# Altium project CBL003.PrjPCB
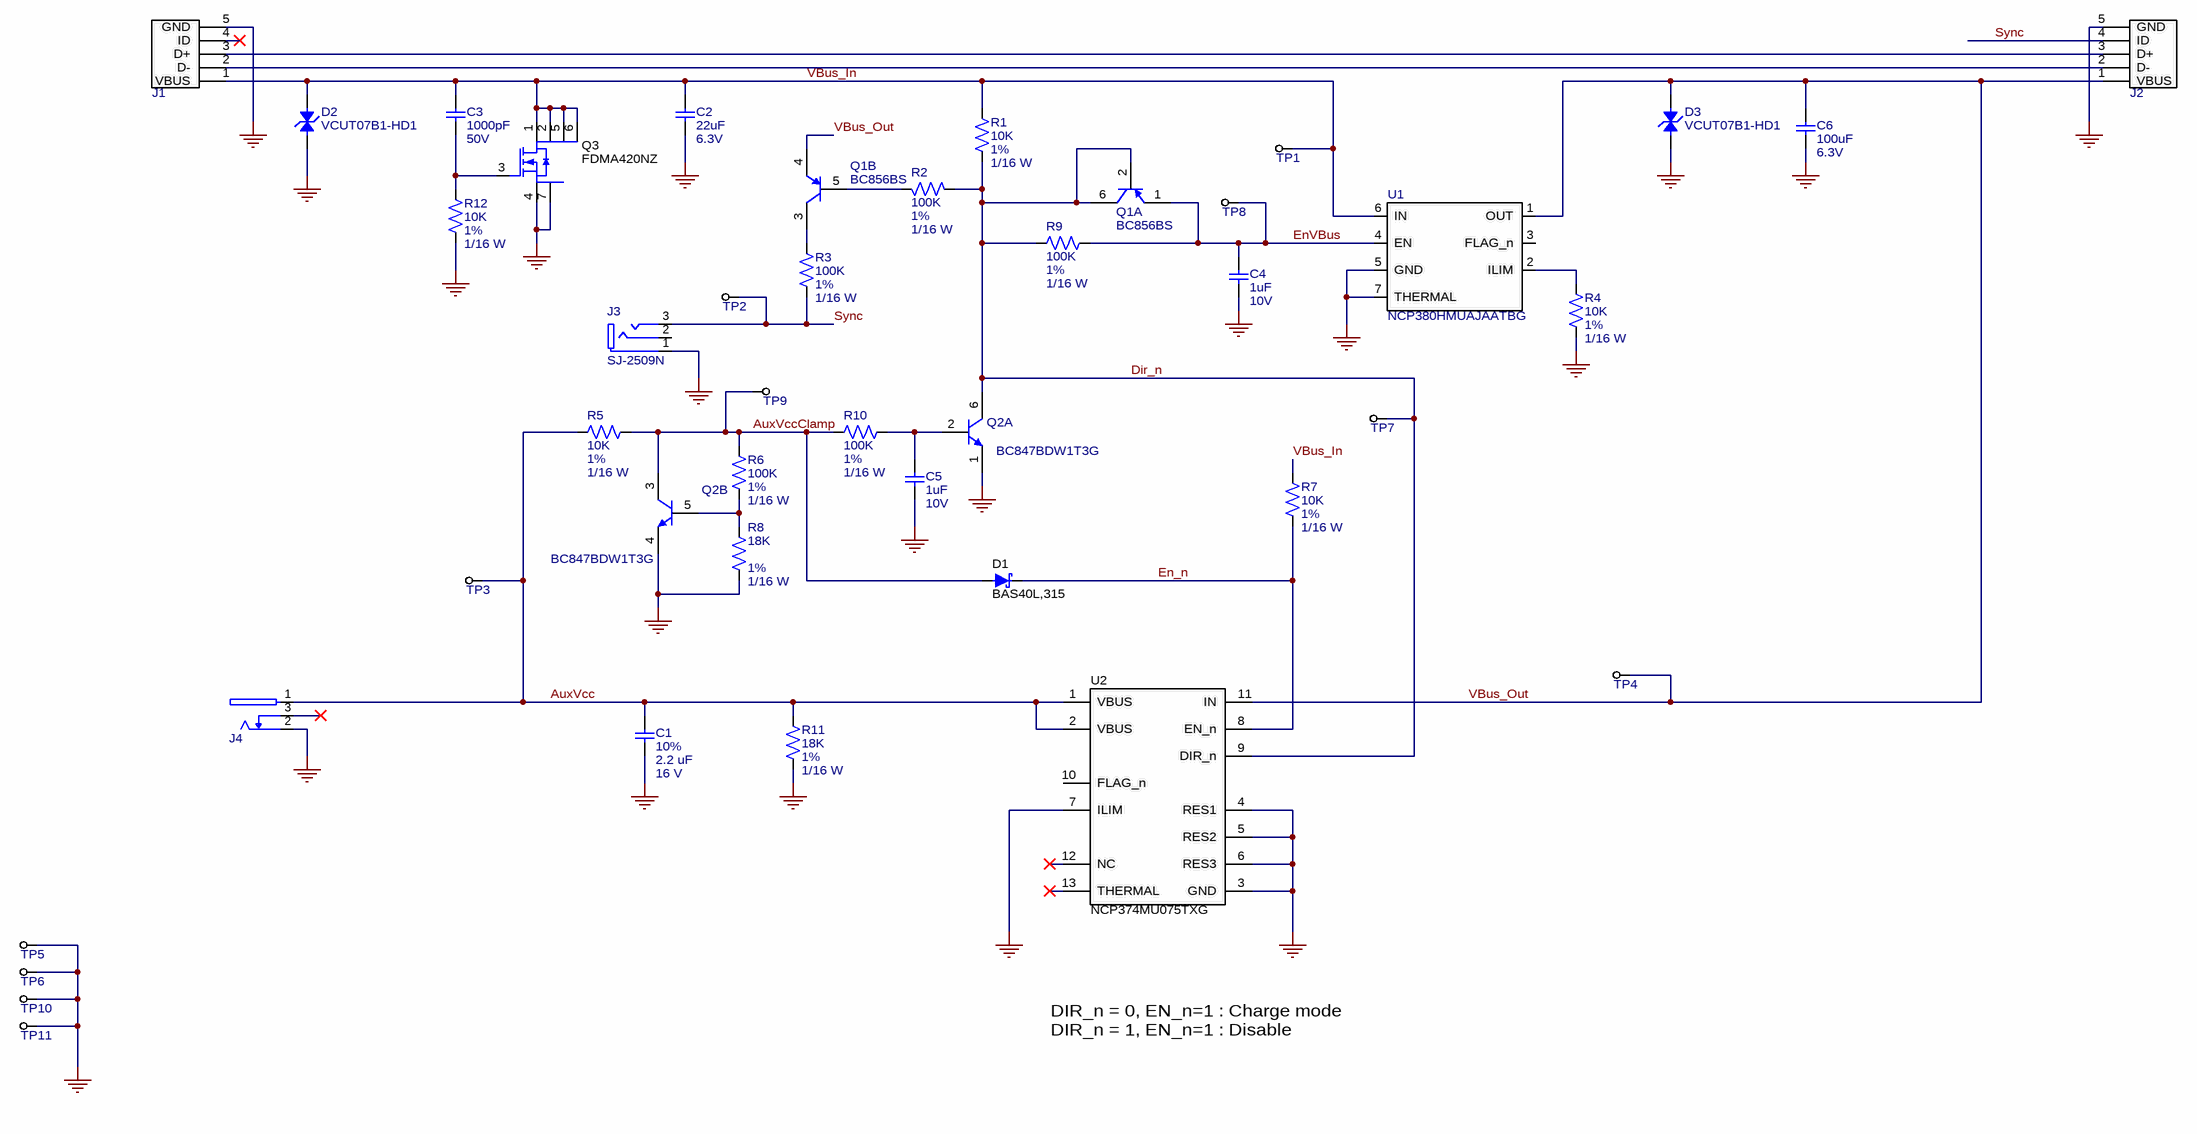
[diagram p0: CBL003.SchDoc]
1 sheet, 41 parts. Net scope: global (net labels, ports and power ports of the same name join across sheets).
Board file: CBL003.PcbDoc

## Sheet CBL003.SchDoc: Confluence Module
size C; Date: 18 MAY 2014; ApprovedBy: APPROVER; Engineer: M. DEVOE; Organization: Altium Limited; Revision: 1; ApprovedDate: 17 DEC 2013; SheetDescription: Confluence Module; PartNumber: CBL003; PageSetup: Record=PageOptions|CenterHorizontal=True|CenterVertical=True|PrintScale=0.65|XCorrection=1.00|YCorrection=1.00|PrintKind=1|BorderSize=5000000|LeftOffset=0|BottomOffset=0|Orientation=2|PaperLength=1000|PaperWidth=1000|Scale=100|PaperSource=262|PrintQuality=600|MediaType=1|DitherType=10|PaperKind=Letter|PrintScaleMode=1

### Parts
C1  value 2.2 uF  Tolerance: 10%  Voltage: 16 V  [CAP_CERAMIC_0603]  (hidden comment: CAP, X7R, 2.2 uF, 10%, 16 V, 0603)
C2  value_text_units: 22uF  Voltage_rating_text: 6.3V  [CAP_CERAMIC_0805]  (hidden comment: 2.2E-5)
C3  value_text_units: 1000pF  Voltage_rating_text: 50V  [CAP_CERAMIC_0603]  (hidden comment: 1E-9)
C4  value_text_units: 1uF  Voltage_rating_text: 10V  [CAP_CERAMIC_0402]  (hidden comment: 1E-6)
C5  value_text_units: 1uF  Voltage_rating_text: 10V  [CAP_CERAMIC_0402]  (hidden comment: 1E-6)
C6  value_text_units: 100uF  Voltage_rating_text: 6.3V  [CAP_CERAMIC_1206]  (hidden comment: 0.0001)
D1  BAS40L,315  [SOD882]
D2  VCUT07B1-HD1  [LLP1006-2L]
D3  VCUT07B1-HD1  [LLP1006-2L]
J1  USB_WIRE_MOUNT  [USB_WIRE_MOUNT]  (value not drawn)  (no BOM)
J2  USB_WIRE_MOUNT  [USB_WIRE_MOUNT]  (value not drawn)  (no BOM)
J3  SJ-2509N  [CUI_SJ2509N]
J4  DC Jack  [KLDX-0202]  (value not drawn)
Q1  Manufacturer_PN: BC856BS  [SOT363]  (hidden comment: TRANSISTOR, DUAL PNP, SOT363)  (parts A,B of 2)
Q2  Manufacturer_PN: BC847BDW1T3G  [SOT363]  (hidden comment: TRANSISTOR, DUAL NPN, SOT363)  (parts A,B of 2)
Q3  FDMA420NZ  [DFN2020-6]
R1  value 10K  Tolerance: 1%  Power: 1/16 W  [RESISTOR_0402]  (hidden comment: RES, 0402, 10K, 1%, 1/16 W)
R2  value 100K  Tolerance: 1%  Power: 1/16 W  [RESISTOR_0402]  (hidden comment: RES, 0402, 100K, 1%, 1/16 W)
R3  value 100K  Tolerance: 1%  Power: 1/16 W  [RESISTOR_0402]  (hidden comment: RES, 0402, 100K, 1%, 1/16 W)
R4  value 10K  Tolerance: 1%  Power: 1/16 W  [RESISTOR_0402]  (hidden comment: RES, 0402, 10K, 1%, 1/16 W)
R5  value 10K  Tolerance: 1%  Power: 1/16 W  [RESISTOR_0402]  (hidden comment: RES, 0402, 10K, 1%, 1/16 W)
R6  value 100K  Tolerance: 1%  Power: 1/16 W  [RESISTOR_0402]  (hidden comment: RES, 0402, 100K, 1%, 1/16 W)
R7  value 10K  Tolerance: 1%  Power: 1/16 W  [RESISTOR_0402]  (hidden comment: RES, 0402, 10K, 1%, 1/16 W)
R8  value 18K  Tolerance: 1%  Power: 1/16 W  [RESISTOR_0402]  (hidden comment: RES, 0402, 18K, 1%, 1/16 W)
R9  value 100K  Tolerance: 1%  Power: 1/16 W  [RESISTOR_0402]  (hidden comment: RES, 0402, 100K, 1%, 1/16 W)
R10  value 100K  Tolerance: 1%  Power: 1/16 W  [RESISTOR_0402]  (hidden comment: RES, 0402, 100K, 1%, 1/16 W)
R11  value 18K  Tolerance: 1%  Power: 1/16 W  [RESISTOR_0402]  (hidden comment: RES, 0402, 18K, 1%, 1/16 W)
R12  value 10K  Tolerance: 1%  Power: 1/16 W  [RESISTOR_0402]  (hidden comment: RES, 0402, 10K, 1%, 1/16 W)
TP1  TESTPOINT  [TESTPOINT40]  (value not drawn)  (no BOM)
TP2  TESTPOINT  [TESTPOINT40]  (value not drawn)  (no BOM)
TP3  TESTPOINT  [TESTPOINT40]  (value not drawn)  (no BOM)
TP4  TESTPOINT  [TESTPOINT40]  (value not drawn)  (no BOM)
TP5  TESTPOINT  [TESTPOINT40]  (value not drawn)  (no BOM)
TP6  TESTPOINT  [TESTPOINT40]  (value not drawn)  (no BOM)
TP7  TESTPOINT  [TESTPOINT40]  (value not drawn)  (no BOM)
TP8  TESTPOINT  [TESTPOINT40]  (value not drawn)  (no BOM)
TP9  TESTPOINT  [TESTPOINT40]  (value not drawn)  (no BOM)
TP10  TESTPOINT  [TESTPOINT40]  (value not drawn)  (no BOM)
TP11  TESTPOINT  [TESTPOINT40]  (value not drawn)  (no BOM)
U1  NCP380HMUAJAATBG  [DFN200X200X050-6]
U2  NCP374MU075TXG  [LLGA12-NCP374]

### Nets
GND: C1.2 C2.2 C4.2 C5.2 C6.2 D2.2 D3.2 J1.5(GND) J2.5(GND) J3.1 J4.2 Q2.1(E1) Q2.4(E2) Q3.4(G) Q3.7(D) R4.1 R8.1 R11.2 R12.1 TP5.1 TP6.1 TP10.1 TP11.1 U1.5(GND) U1.7(THERMAL) U2.3(GND) U2.4(RES1) U2.5(RES2) U2.6(RES3) U2.7(ILIM)
AuxVcc: C1.1 J4.1 R5.1 R11.1 TP3.1 U2.1(VBUS) U2.2(VBUS)
AuxVccClamp: D1.1(A) Q2.3(C2) R5.2 R6.2 R10.1 TP9.1
Dir_n: Q1.2(B) Q1.6(C) Q2.6(C1) R1.1 R2.1 R9.2 TP7.1 U2.9(DIR_n)
En_n: D1.2(C) R7.2 U2.8(EN_n)
EnVBus: C4.1 Q1.1(E) R9.1 TP8.1 U1.4(EN)
Sync: J2.4(ID) J3.3 R3.1 TP2.1
VBus_In: C2.1 C3.1 D2.1 J1.1(VBUS) Q3.1(S) Q3.2(S) Q3.5(D) Q3.6(D) R1.2 R7.1 TP1.1 U1.6(IN)
VBus_Out: C6.1 D3.1 J2.1(VBUS) Q1.4(E) TP4.1 U1.1(OUT) U2.11(IN)
NetC3_2: C3.2 Q3.3(S) R12.2
NetC5_1: C5.1 Q2.2(B1) R10.2
NetJ1_2: J1.2(D-) J2.2(D-)
NetJ1_3: J1.3(D+) J2.3(D+)
NetQ1_3: Q1.3(C) R3.2
NetQ1_5: Q1.5(B) R2.2
NetQ2_5: Q2.5(B2) R6.1 R8.2
NetR4_2: R4.2 U1.2(ILIM)

Not connected (* = marked no-connect by the designer): J1 4(ID)*; J3 2; J4 3*; U1 3(FLAG_n); U2 10(FLAG_n) 12(NC)* 13(THERMAL)*

### Notes on the sheet
- DIR_n = 0, EN_n=1 : Charge mode
  DIR_n = 1, EN_n=1 : Disable
- TITLE
- ENGINEER
- APPROVED
- DATE
- THIS DOCUMENT IS CONFIDENTIAL AND CONTAINS DESIGNS AND OTHER INFORMATION WHICH ARE THE PROPERTY OF OCULUS AND MAY NOT, IN WHOLE OR IN PART, BE DUPLICATED OR DISCLOSED OR USED FOR THE MANUFACTURE OF THE PART DISCLOSED HEREIN OR FOR ANY OTHER PURPOSE WITHOUT THE PRIOR WRITTEN PERMISSION OF OCULUS.
- SHEET DESCRIPTION
- SIZE
- C
- TYPE
- SCH
- PART NUMBER
- REVISION
- SHEET
- of

### Library data of the parts
C1 = CAP-NONPOL: ='CAP, ' + Material + ', ' + Value + ', ' + Tolerance + ', '  + Voltage + ', ' + Package; Manufacturer: TDK; Manufacturer_PN: C1608X5R1C225K080AB; Material: X7R; Package: 0603
C2 = 120-000023: CAP, CERAMIC, 22UF, ±20%, 6.3V, X5R, 0805; Manufacturer: Murata; Manufacturer_PN: GRM21BR60J226ME39L; Package_text: 0805, X5R; Tolerance: 20; Voltage: 6.3; active: 1; committed: 0; value_text: 22u; Value: 2.2E-5; Material: X5R; Tolerance_percent: ±20 %; partnumber: 120-000023; Package: 0805; Created_on: 2/9/2014 5:49:45 PM; parttype: Capacitor; rohs: 1; updated_on: 2/9/2014 5:49:45 PM
C3 = 120-000031: CAP, CERAMIC, 1000PF, ±10%, 50V, C0G, 0603; Manufacturer: Murata; Manufacturer_PN: GRM1885C1H102JA01D; Package_text: 0603, C0G; Tolerance_percent: ±5 %; Tolerance: 5; Voltage: 50; active: 1; committed: 0; value_text: 1000p; Value: 1E-9; Material: C0G; partnumber: 120-000031; Package: 0603; Created_on: 5/13/2014 4:19:32 AM; parttype: Capacitor; rohs: 1; updated_on: 5/13/2014 4:19:32 AM
C4 C5 = 120-000010: CAP, CERAMIC, 1uF, ±10%, 10V, X5R, 0402; Manufacturer: Murata; Manufacturer_PN: GRM155R61A105KE15D; Package_text: 0402, X5R; Tolerance: 10; active: 1; committed: 0; value_text: 1u; Part Number: *; Package: 0402; Tolerance_percent: ±10%; Material: X5R; Value: 1E-6; partnumber: 120-000010; Created_on: 11/7/2013 3:49:47 PM; Voltage: 10; parttype: Capacitor; rohs: 1; updated_on: 1/8/2014 6:24:24 PM
C6 = 120-000030: CAP, CERAMIC, 100UF, ±20%, 6.3V, X5R, 1206; Manufacturer: Murata; Manufacturer_PN: GRM31CR60J107ME39L; Package_text: 1206, X5R; Tolerance: 20; Voltage: 6.3; active: 1; committed: 0; value_text: 100u; Value: 0.0001; Material: X5R; Tolerance_percent: ±20 %; partnumber: 120-000030; Package: 1206; Created_on: 5/2/2014 1:23:08 PM; parttype: Capacitor; rohs: 1; updated_on: 5/2/2014 1:23:48 PM
D1 = 150-000003: DIODE, SCHOTTKY, 40V, SOD882; manufacturer: NXP; active: 1; committed: 0; manufacturer_pn: BAS40L,315; partnumber: 150-000003; Package: SOD882; Created_on: 3/9/2014 3:25:19 PM; parttype: Diode; rohs: 1; updated_on: 3/9/2014 3:53:05 PM
D2 D3 = VCUT07B1-HD1: DIODE, ESD SUPPRESSOR, SINGLE LINE BI-DIRECTIONAL, LLP1006-2L; Manufacturer: Vishay; active: 1; committed: 0; manufacturer_pn: VCUT07B1-HD1; Created_on: 1/2/2014 7:11:16 PM; parttype: Diode; rohs: -1; updated_on: 1/2/2014 7:12:49 PM
J3 = AUDIO_JACK_3P: CONN, 2.5MM AUDIO JACK; Manufacturer: CUI; Manufacturer_PN: SJ-2509N
J4 = DC_JACK: CONN, DC POWER JACK; Manufacturer: Kycon; Manufacturer_PN: KLDX-0202-A
Q1 = PNP_DUAL: ='TRANSISTOR, DUAL PNP, ' + Package; Manufacturer: NXP; Package: SOT363
Q2 = NPN_DUAL: ='TRANSISTOR, DUAL NPN, ' + Package; Manufacturer: ON Semi; Package: SOT363
Q3 = 170-000003: TRANS, NMOS, DFN2020-6; manufacturer: Fairchild Semiconductor; active: 1; committed: 0; manufacturer_pn: FDMA420NZ; partnumber: 170-000003; Package: DFN2020-6; Created_on: 5/13/2014 2:34:31 AM; parttype: Transistor; rohs: 1; updated_on: 5/13/2014 3:10:06 AM
R1 R4 R5 R7 R12 = RESISTOR: ='RES, ' + Package + ', ' + Value + ', ' + Tolerance + ', '  + Power; Manufacturer: Yageo; Manufacturer_PN: RC0402FR-0710KL; Package: 0402
R2 R3 R6 R9 R10 = RESISTOR: ='RES, ' + Package + ', ' + Value + ', ' + Tolerance + ', '  + Power; Manufacturer: KOA Speer; Manufacturer_PN: RK73H1ETTP1003F; Package: 0402
R8 R11 = RESISTOR: ='RES, ' + Package + ', ' + Value + ', ' + Tolerance + ', '  + Power; Manufacturer: Yageo; Manufacturer_PN: RC0402FR-0718KL; Package: 0402
U1 = NCP380: IC, LOAD SWITCH, UDFN6; Manufacturer: ON Semi; Manufacturer_PN: NCP380HMUAJAATBG
U2 = 300-000021: IC, LOAD SWITCH WITH OVP/RVP, LLGA-12; Manufacturer: ON Semiconductor; active: 1; committed: 0; Manufacturer_PN: NCP374MU075TXG; partnumber: 300-000021; Lifecycle: Preliminary; Package: LLGA-12, 4MMX4MM; Created_on: 12/14/2013 3:55:33 PM; parttype: IC; rohs: 1; updated_on: 12/16/2013 11:17:59 AM